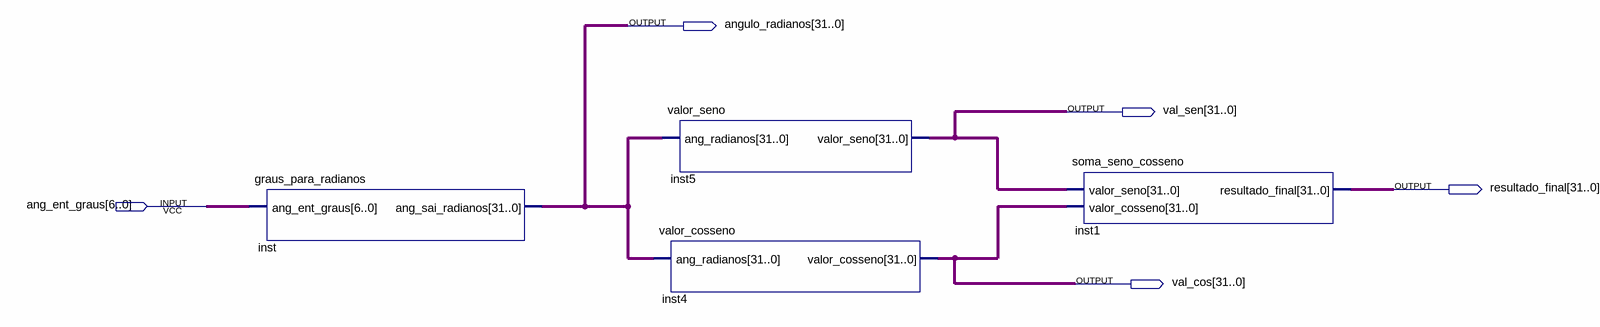
[diagram p0: schematic sheet]
// Quartus schematic Block3.bdf as structural Verilog: 4 symbols, 5 pins
module Block3 (
  input  [6:0] ang_ent_graus,
  output [31:0] angulo_radianos,
  output [31:0] val_sen,
  output [31:0] resultado_final,
  output [31:0] val_cos
);

  graus_para_radianos inst (.ang_ent_graus(ang_ent_graus), .ang_sai_radianos(angulo_radianos));
  valor_seno inst5 (.ang_radianos(angulo_radianos), .valor_seno(val_sen));
  valor_cosseno inst4 (.ang_radianos(angulo_radianos), .valor_cosseno(val_cos));
  soma_seno_cosseno inst1 (.valor_seno(val_sen), .valor_cosseno(val_cos), .resultado_final(resultado_final));
endmodule
